# Altium schematic sheet DSPpanel_v2.SchDoc
size A4
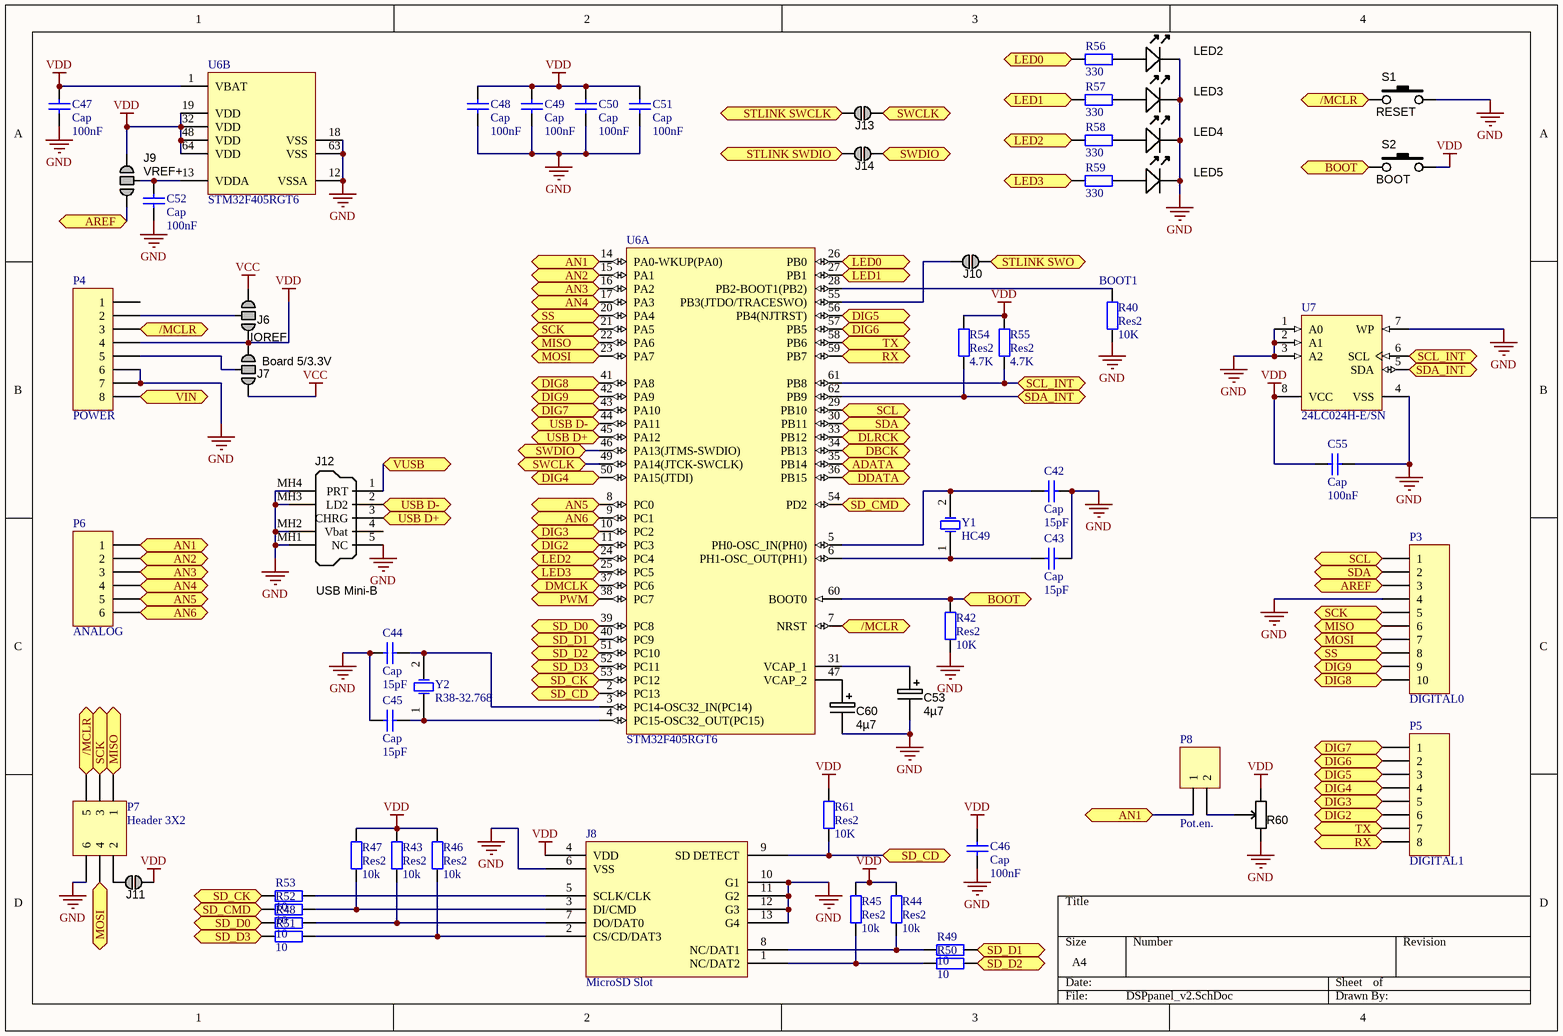
[diagram p0: DSPpanel_v2.SchDoc]

## Parts
C42  Cap  value 15pF  [CAPC2012X135N]
C43  Cap  value 15pF  [CAPC2012X135N]
C44  Cap  value 15pF  [CAPC2012X135N]
C45  Cap  value 15pF  [CAPC2012X135N]
C46  Cap  value 100nF  [CAPC2012X135N]
C47  Cap  value 100nF  [CAPC2012X135N]
C48  Cap  value 100nF  [CAPC2012X135N]
C49  Cap  value 100nF  [CAPC2012X135N]
C50  Cap  value 100nF  [CAPC2012X135N]
C51  Cap  value 100nF  [CAPC2012X135N]
C52  Cap  value 100nF  [CAPC2012X135N]
C53  4µ7  [CAPMP3216X180N]
C55  Cap  value 100nF  [CAPC2012X135N]
C60  4µ7  [CAPMP3216X180N]
J6  IOREF  [Jump_3Way]  (no BOM)
J7  Board 5/3.3V  [Jump_3Way]  (no BOM)
J8  MicroSD Slot  [MICROSD Slot]
J9  VREF+  [Jump_3Way]  (no BOM)
J10  Jumper  [JUMP1]  (value not drawn)  (no BOM)
J11  Jumper  [JUMP1]  (value not drawn)  (no BOM)
J12  USB Mini-B  [USB_Mini-B_Molex_SMT]
J13  Jumper  [JUMP1]  (value not drawn)  (no BOM)
J14  Jumper  [JUMP1]  (value not drawn)  (no BOM)
LED2  B0  [LED-0805-K]  (value not drawn)
LED3  B1  [LED-0805-K]  (value not drawn)
LED4  C4  [LED-0805-K]  (value not drawn)
LED5  C5  [LED-0805-K]  (value not drawn)
P3  DIGITAL0  [HDR1X10]
P4  POWER  [HDR1X8]
P5  DIGITAL1  [HDR1X8]
P6  ANALOG  [HDR1X6]
P7  Header 3X2  [HDR2X3]
P8  Pot.en.  [HDR1X2]
R40  Res2  value 10K  [RESC2012X70N]
R42  Res2  value 10K  [RESC2012X70N]
R43  Res2  value 10k  [RESC2012X70N]
R44  Res2  value 10k  [RESC2012X70N]
R45  Res2  value 10k  [RESC2012X70N]
R46  Res2  value 10k  [RESC2012X70N]
R47  Res2  value 10k  [RESC2012X70N]
R48  value 10  [RESC2012X70N]  (hidden comment: Res2)
R49  value 10  [RESC2012X70N]  (hidden comment: Res2)
R50  value 10  [RESC2012X70N]  (hidden comment: Res2)
R51  value 10  [RESC2012X70N]  (hidden comment: Res2)
R52  value 10  [RESC2012X70N]  (hidden comment: Res2)
R53  value 10  [RESC2012X70N]  (hidden comment: Res2)
R54  Res2  value 4.7K  [RESC2012X70N]
R55  Res2  value 4.7K  [RESC2012X70N]
R56  value 330  [RESC2012X70N]  (hidden comment: Res2)
R57  value 330  [RESC2012X70N]  (hidden comment: Res2)
R58  value 330  [RESC2012X70N]  (hidden comment: Res2)
R59  value 330  [RESC2012X70N]  (hidden comment: Res2)
R60  25 turns  [PT-105]  (value not drawn)
R61  Res2  value 10K  [RESC2012X70N]
S1  RESET  [TACT6x3]
S2  BOOT  [TACT6x3]
U6  STM32F405RGT6  [STM-LQFP64_M]  (parts A,B of 2)
U7  24LC024H-E/SN  [SOIC-SN8_M]
Y1  HC49  [HC49/4H_SMX]
Y2  R38-32.768  [R38]

## Ports
/MCLR, ADATA (out), AN1, AN2, AN3, AN4, AN5, AN6, AREF, BOOT, DBCK (bidir), DDATA (in), DIG2, DIG3, DIG4, DIG5, DIG6, DIG7, DIG8, DIG9, DLRCK (bidir), DMCLK (bidir), LED0, LED1, LED2, LED3, MISO, MOSI, PWM, RX, SCK, SCL, SCL_INT (bidir), SD_CD, SD_CK, SD_CMD, SD_D0, SD_D1, SD_D2, SD_D3, SDA, SDA_INT (bidir), SS, STLINK SWCLK (bidir), STLINK SWDIO (bidir), STLINK SWO (bidir), SWCLK (bidir), SWDIO (bidir), TX, USB D+ (bidir), USB D- (bidir), VIN, VUSB

## Nets
GND: C42.2 C43.2 C44.1 C45.1 C46.1 C47.1 C48.1 C49.1 C50.1 C51.1 C52.1 C53.2 C55.1 C60.2 J8.6(VSS) J8.10(G1) J8.11(G2) J8.12(G3) J8.13(G4) J12.5(NC) J12.MH1(Shell) J12.MH2(Shell) J12.MH3(Shell) J12.MH4(Shell) LED2.K LED3.K LED4.K LED5.K P3.4 P4.6 P4.7 P7.6 R40.1 R42.1 R60.3 S1.2 U6.12(VSSA) U6.18(VSS) U6.63(VSS) U7.1(A0) U7.2(A1) U7.3(A2) U7.4(VSS) U7.7(WP)
VCC: J6.1 J7.3
VDD: C46.2 C47.2 C48.2 C49.2 C50.2 C51.2 C55.2 J6.3 J7.1 J8.4(VDD) J9.3 J11.1 P4.4 R43.2 R44.2 R45.2 R46.2 R47.2 R54.2 R55.2 R60.1 R61.2 S2.2 U6.1(VBAT) U6.19(VDD) U6.32(VDD) U6.48(VDD) U6.64(VDD) U7.8(VCC)
/MCLR: P4.3 P7.5 S1.1 U6.7(NRST) ; port /MCLR
ADATA: U6.35(PB14) ; port ADATA
AN1: P6.1 P8.1 U6.14(PA0-WKUP(PA0)) ; port AN1
AN2: P6.2 U6.15(PA1) ; port AN2
AN3: P6.3 U6.16(PA2) ; port AN3
AN4: P6.4 U6.17(PA3) ; port AN4
AN5: P6.5 U6.8(PC0) ; port AN5
AN6: P6.6 U6.9(PC1) ; port AN6
AREF: J9.1 P3.3 ; port AREF
BOOT: R42.2 S2.1 U6.60(BOOT0) ; port BOOT
DBCK: U6.34(PB13) ; port DBCK
DDATA: U6.36(PB15) ; port DDATA
DIG2: P5.6 U6.11(PC3) ; port DIG2
DIG3: P5.5 U6.10(PC2) ; port DIG3
DIG4: P5.4 U6.50(PA15(JTDI)) ; port DIG4
DIG5: P5.3 U6.56(PB4(NJTRST)) ; port DIG5
DIG6: P5.2 U6.57(PB5) ; port DIG6
DIG7: P5.1 U6.43(PA10) ; port DIG7
DIG8: P3.10 U6.41(PA8) ; port DIG8
DIG9: P3.9 U6.42(PA9) ; port DIG9
DLRCK: U6.33(PB12) ; port DLRCK
DMCLK: U6.37(PC6) ; port DMCLK
LED0: R56.2 U6.26(PB0) ; port LED0
LED1: R57.2 U6.27(PB1) ; port LED1
LED2: R58.2 U6.24(PC4) ; port LED2
LED3: R59.2 U6.25(PC5) ; port LED3
MISO: P3.6 P7.1 U6.22(PA6) ; port MISO
MOSI: P3.7 P7.4 U6.23(PA7) ; port MOSI
PWM: U6.38(PC7) ; port PWM
RX: P5.8 U6.59(PB7) ; port RX
SCK: P3.5 P7.3 U6.21(PA5) ; port SCK
SCL: P3.1 U6.29(PB10) ; port SCL
SCL_INT: R55.1 U6.61(PB8) U7.6(SCL) ; port SCL_INT
SD_CD: J8.9(SD_DETECT) R61.1 U6.2(PC13) ; port SD_CD
SD_CK: R53.2 U6.53(PC12) ; port SD_CK
SD_CMD: R52.2 U6.54(PD2) ; port SD_CMD
SD_D0: R48.2 U6.39(PC8) ; port SD_D0
SD_D1: R49.2 U6.40(PC9) ; port SD_D1
SD_D2: R50.2 U6.51(PC10) ; port SD_D2
SD_D3: R51.2 U6.52(PC11) ; port SD_D3
SDA: P3.2 U6.30(PB11) ; port SDA
SDA_INT: R54.1 U6.62(PB9) U7.5(SDA) ; port SDA_INT
SS: P3.8 U6.20(PA4) ; port SS
STLINK SWCLK: J13.2 ; port STLINK SWCLK
STLINK SWDIO: J14.2 ; port STLINK SWDIO
STLINK SWO: J10.1 ; port STLINK SWO
SWCLK: J13.1 U6.49(PA14(JTCK-SWCLK)) ; port SWCLK
SWDIO: J14.1 U6.46(PA13(JTMS-SWDIO)) ; port SWDIO
TX: P5.7 U6.58(PB6) ; port TX
USB D+: J12.3(CHRG) U6.45(PA12) ; port USB D+
USB D-: J12.2(LD2) U6.44(PA11) ; port USB D-
VIN: P4.8 ; port VIN
VUSB: J12.1(PRT) ; port VUSB
NetC42_1: C42.1 U6.5(PH0-OSC_IN(PH0)) Y1.2(OSC2)
NetC43_1: C43.1 U6.6(PH1-OSC_OUT(PH1)) Y1.1(OSC1)
NetC44_2: C44.2 U6.3(PC14-OSC32_IN(PC14)) Y2.2(OSC2)
NetC45_2: C45.2 U6.4(PC15-OSC32_OUT(PC15)) Y2.1(OSC1)
NetC52_2: C52.2 J9.2 U6.13(VDDA)
NetC53_1: C53.1 U6.31(VCAP_1)
NetC60_1: C60.1 U6.47(VCAP_2)
NetJ6_2: J6.2 P4.2
NetJ7_2: J7.2 P4.5
NetJ8_1: J8.1(NC/DAT2) R45.1 R50.1
NetJ8_2: J8.2(CS/CD/DAT3) R46.1 R51.1
NetJ8_3: J8.3(DI/CMD) R47.1 R52.1
NetJ8_5: J8.5(SCLK/CLK) R53.1
NetJ8_7: J8.7(DO/DAT0) R43.1 R48.1
NetJ8_8: J8.8(NC/DAT1) R44.1 R49.1
NetJ10_2: J10.2 U6.55(PB3(JTDO/TRACESWO))
NetJ11_2: J11.2 P7.2
NetLED2_A: LED2.A R56.1
NetLED3_A: LED3.A R57.1
NetLED4_A: LED4.A R58.1
NetLED5_A: LED5.A R59.1
NetP8_2: P8.2 R60.2
NetR40_2: R40.2 U6.28(PB2-BOOT1(PB2))

Not connected (* = marked no-connect by the designer): J12 4(Vbat); P4 1

## Notes on the sheet
- (near R40) BOOT1

## Library data of the parts
C42-C52 C55 = Cap: Capacitor; Published: 8-Jun-2000; LatestRevisionDate: 17-Jul-2002; LatestRevisionNote: Re-released for DXP Platform.; PackageReference: RAD-0.3; Publisher: Altium Limited; PackageDescription: Radial Cap, Thru-Hole; 2 Leads; 0.3 in Pin Spacing
C53 C60 = CAPT_4u7_3216_16V: Capacitor SMD Tantalum 4.7uF 10% 16V 3216-18; Manufacturer 1: Vishay/Sprague; Manufacturer Part Number 1: 293D475X9016A2TE3; SCDType: undef; Package / Case: EIA 535BAAC size A; Ratings: 16V; Tolerance: ±10%; Material: Tantalum; Supplier 1: Digi-Key; Supplier Part Number 1: 718-1148-1-ND; Value: 4µ7
J6 J7 J9 = JUMP_3WAY: SMD jumper
J10 J11 J13 J14 = JUMP1: SMD jumper
J12 = USB_Mini-B: Connector SMD USB Type Mini-B; Manufacturer 1: Molex Connector Corporation; Manufacturer Part Number 1: 67503-1020; SCDType: undef; Package / Case: SMD; Supplier 1: Digi-Key; Supplier Part Number 1: WM5461CT-ND
LED2-LED5 = LED_SMD_Red_0805_6mcd: LED 0805 SMD Red 6mcd 621nm; Manufacturer 1: Lite-On Inc; Manufacturer Part Number 1: LTST-C171EKT; Material: GaAsP on GaP; Ratings: 6 mcd; 621 nm; SCDType: source; Package / Case: 0805; Supplier 1: Digi-Key; Supplier Part Number 1: 160-1422-1-ND; Value: Red; Color: Red
P3 = Header 10: Header, 10-Pin; LatestRevisionDate: 17-Jul-2002; LatestRevisionNote: Re-released for DXP Platform.; Publisher: Altium Limited
P4 P5 = Header 8: Header, 8-Pin; LatestRevisionDate: 17-Jul-2002; LatestRevisionNote: Re-released for DXP Platform.; Publisher: Altium Limited
P6 = Header 6: Header, 6-Pin; LatestRevisionDate: 17-Jul-2002; LatestRevisionNote: Re-released for DXP Platform.; Publisher: Altium Limited
P7 = Header 3X2: Header, 3-Pin, Dual row; LatestRevisionDate: 17-Jul-2002; LatestRevisionNote: Re-released for DXP Platform.; Publisher: Altium Limited
P8 = Header 2: Header, 2-Pin; LatestRevisionDate: 17-Jul-2002; LatestRevisionNote: Re-released for DXP Platform.; Publisher: Altium Limited
R40 R42-R59 R61 = Res2: Resistor; Published: 8-Jun-2000; LatestRevisionDate: 17-Jul-2002; LatestRevisionNote: Re-released for DXP Platform.; PackageReference: AXIAL-0.4; Publisher: Altium Limited; PackageDescription: Axial Device, Thru-Hole; 2 Leads; 0.4 in Pin Spacing
R60 = POT: Trimmer THD; Tolerance: ±10%; Ratings: 1/2W; ±100ppm/°C; SCDType: spec; Material: Cermet; Package / Case: 10.9mm L x 5.0mm W x 10.0mm H
S1 S2 = SW_THT_PB_5.0mm: Switch, tact, 5.0mm stem; Manufacturer 1: Wealth Metal; Manufacturer Part Number 1: TC-37XB; Function: On/Off; SCDType: spec; Package / Case: 6.5x6.5mm; 5.0mm stem; Material: Brass/Nylon/Ag plating
U6 = STM32F405RGT6: ARM Cortex-M4 32-bit MCU+FPU, 210 DMIPS, 1024 kB Flash, 192 kB Internal RAM, 51 I/Os, 64-pin LQFP, -40 to 85 degC, Tray; Manufacturer: STMicroelectronics; D/A Converter: 2x12-bit; FLASH Size (Prog) (kB): 1024; I/Os (High Current): 51; Internal RAM Size (kB): 192; Operating Frequency(F) (Processor speed) (MHz): 168; Supply Voltage(Vcc) max (V): 3.6; Supply Voltage(Vcc) min (V): 1.8; DatasheetVersion: Rev. 4; PackageVersion: Rev. 4, 06/2013; PackageReference: LQFP64; PackageDescription: 64-Pin Low Profile Quad Flat Package, 10 x 10 mm Body, 0.5 mm Pitch; Supplier 1: Digi-Key; Supplier Part Number 1: 497-11767-ND; Supplier 2: Farnell; Supplier Part Number 2: 2064363; Supplier 3: Newark; Supplier Part Number 3: 73T2329; Supplier 4: Mouser; Supplier Part Number 4: 511-STM32F405RGT6; Core: ARM Cortex-M4; Packing: Tray; Mounting Technology: Surface Mount; PartNumber: STM32F405RGT6; ComponentLink1Description: Manufacturer URL; ComponentLink1URL: http://www.st.com/web/en/home.html; ComponentLink2Description: Datasheet; ComponentLink2URL: http://www.st.com/st-web-ui/static/active/en/resource/technical/document/datasheet/DM00037051.pdf; ComponentLink3Description: Package Specification; ComponentLink3URL: http://www.st.com/st-web-ui/static/active/en/resource/technical/document/datasheet/DM00037051.pdf
U7 = 24LC024H-E/SN: 2Kbit, 1MHz, 2.5V, Addressable Serial EEPROM, 8-Pin SOIC 150mil, Extended Temperature; Manufacturer: Microchip; DatasheetVersion: revA, Aug-2008; PackageVersion: revBB, Aug-2009; PackageReference: SOIC-SN8; PackageDescription: 8-Lead Plastic Small Outline (SN) - Narrow, 3.90mm Body [SOIC]; Supplier 1: Digi-Key; Supplier Part Number 1: 24LC024H-E/SN-ND; Supplier 2: Mouser; Supplier Part Number 2: 579-24LC024H-E/SN; Mounting Technology: Surface Mount; Code_JEDEC: MS-012; Code_IPC: SOIC127P600-8; PartNumber: 24LC024H-E/SN; ComponentLink1Description: Manufacturer URL; ComponentLink1URL: http://www.microchip.com/; ComponentLink2Description: Datasheet; ComponentLink2URL: http://ww1.microchip.com/downloads/en/DeviceDoc/22102A.pdf; ComponentLink3Description: Package Specification; ComponentLink3URL: http://www.microchip.com/stellent/groups/techpub_sg/documents/packagingspec/en012702.pdf
Y1 = HC49/4H_SMX: Surface Mount Quartz Crystal; Note: PCB layout complies with manufacturer's recommendation.; Published: 17-Jul-2002; DatasheetDocument: 18-Oct-1999; PackageDocument: 18-Oct-1999; PackageReference: HC49/4H_SMX; Publisher: Altium Limited; ComponentLink1Description: Manufacturer Link; ComponentLink1URL: http://www.cmac.com/mt/; ComponentLink2Description: Datasheet; ComponentLink2URL: http://www.cmac.com/mt/databook/crystals/smd/hc49_4h_smx.pdf
Y2 = R38-32.768: Tuning Fork Crystal Unit; Published: 8-Jun-2000; LatestRevisionDate: 17-Jul-2002; LatestRevisionNote: Re-released for DXP Platform.; DatasheetDocument: 28-Sep-1998; PackageReference: R38; Publisher: Altium Limited; ComponentLink1Description: Manufacturer Link; ComponentLink1URL: http://www.raltron.com/products/microcrystals/default.asp; ComponentLink2Description: Datasheet; ComponentLink2URL: http://www.raltron.com/products/pdfspecs/crystal_r38_26_145.pdf